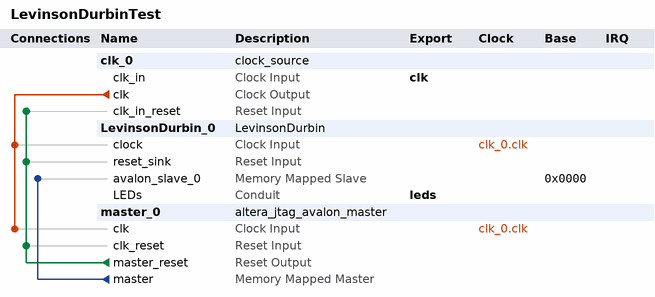
[diagram p0: system contents]
# Platform Designer (Qsys) system LevinsonDurbinTest, Cyclone V 5CEFA2F23C8
# Parameters at their usual value, and those the tool derives, are not listed.
package require -exact qsys 14.1
create_system LevinsonDurbinTest
set_project_property DEVICE_FAMILY {Cyclone V}
set_project_property DEVICE 5CEFA2F23C8

add_instance clk_0 clock_source 14.1
set_instance_parameter_value clk_0 clockFrequency 50000000

add_instance LevinsonDurbin_0 LevinsonDurbin 1.0
set_instance_parameter_value LevinsonDurbin_0 S0 0
set_instance_parameter_value LevinsonDurbin_0 S1 1
set_instance_parameter_value LevinsonDurbin_0 S2 2

add_instance master_0 altera_jtag_avalon_master 14.1

# connections
add_connection clk_0.clk LevinsonDurbin_0.clock clock
add_connection clk_0.clk master_0.clk clock
add_connection master_0.master_reset clk_0.clk_in_reset reset
add_connection master_0.master_reset LevinsonDurbin_0.reset_sink reset
add_connection master_0.master_reset master_0.clk_reset reset
add_connection master_0.master LevinsonDurbin_0.avalon_slave_0 avalon
set_connection_parameter_value master_0.master/LevinsonDurbin_0.avalon_slave_0 baseAddress 0x0000

# exported interfaces
add_interface clk clock sink
set_interface_property clk EXPORT_OF clk_0.clk_in
add_interface leds conduit end
set_interface_property leds EXPORT_OF LevinsonDurbin_0.LEDs

set_interconnect_requirement {$system} qsys_mm.clockCrossingAdapter HANDSHAKE
set_interconnect_requirement {$system} qsys_mm.insertDefaultSlave FALSE
set_interconnect_requirement {$system} qsys_mm.maxAdditionalLatency 1

save_system LevinsonDurbinTest.qsys
